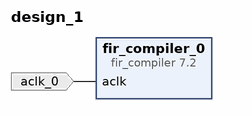
[diagram p0: block diagram of the top level]
# Vivado block design design_1, xc7k70tfbg484-2L, Vivado 2017.4
create_bd_design design_1

create_bd_port -dir I -type clk aclk_0
set_property -dict {CONFIG.FREQ_HZ 192000000} [get_bd_ports aclk_0]

create_bd_cell -type ip -vlnv xilinx.com:ip:fir_compiler:7.2 fir_compiler_0
set_property -dict [list \
  CONFIG.CoefficientVector {-870, -789, -694, -584, -462, -327, -180, -24, 140, 310, 486, 664, 842, 1019, 1191, 1357, 1515, 1661, 1793, 1910, 2008, 2087, 2143, 2176, 2183, 2163, 2116, 2040, 1936, 1802, 1640, 1449, 1231, 986, 717, 426, 114, -215, -558, -913, -1276, -1642, -2008, -2369, -2722, -3061, -3382, -3680, -3950, -4189, -4391, -4552, -4668, -4736, -4750, -4709, -4609, -4448, -4224, -3934, -3578, -3156, -2667, -2111, -1490, -805, -59, 745, 1606, 2518, 3477, 4478, 5517, 6588, 7684, 8799, 9927, 11060, 12192, 13315, 14423, 15508, 16562, 17579, 18553, 19475, 20341, 21143, 21877, 22538, 23120, 23620, 24033, 24358, 24592, 24733, 24780, 24733, 24592, 24358, 24033, 23620, 23120, 22538, 21877, 21143, 20341, 19475, 18553, 17579, 16562, 15508, 14423, 13315, 12192, 11060, 9927, 8799, 7684, 6588, 5517, 4478, 3477, 2518, 1606, 745, -59, -805, -1490, -2111, -2667, -3156, -3578, -3934, -4224, -4448, -4609, -4709, -4750, -4736, -4668, -4552, -4391, -4189, -3950, -3680, -3382, -3061, -2722, -2369, -2008, -1642, -1276, -913, -558, -215, 114, 426, 717, 986, 1231, 1449, 1640, 1802, 1936, 2040, 2116, 2163, 2183, 2176, 2143, 2087, 2008, 1910, 1793, 1661, 1515, 1357, 1191, 1019, 842, 664, 486, 310, 140, -24, -180, -327, -462, -584, -694, -789, -870} \
  CONFIG.Coefficient_Sets 1 \
  CONFIG.Clock_Frequency 192 \
  CONFIG.Coefficient_Sign Signed \
  CONFIG.Quantization Integer_Coefficients \
  CONFIG.Coefficient_Width 32 \
  CONFIG.Coefficient_Fractional_Bits 0 \
  CONFIG.Coefficient_Structure Symmetric \
  CONFIG.Data_Width 32 \
  CONFIG.Output_Rounding_Mode Full_Precision \
  CONFIG.Output_Width 53 \
  CONFIG.Filter_Architecture Systolic_Multiply_Accumulate \
] [get_bd_cells fir_compiler_0]

# ---- connections ----

connect_bd_net -net aclk_0_1 [get_bd_ports aclk_0] [get_bd_pins fir_compiler_0/aclk]

validate_bd_design
save_bd_design
